# EAGLE design tuer-steuerung (EAGLE 6.5.0)
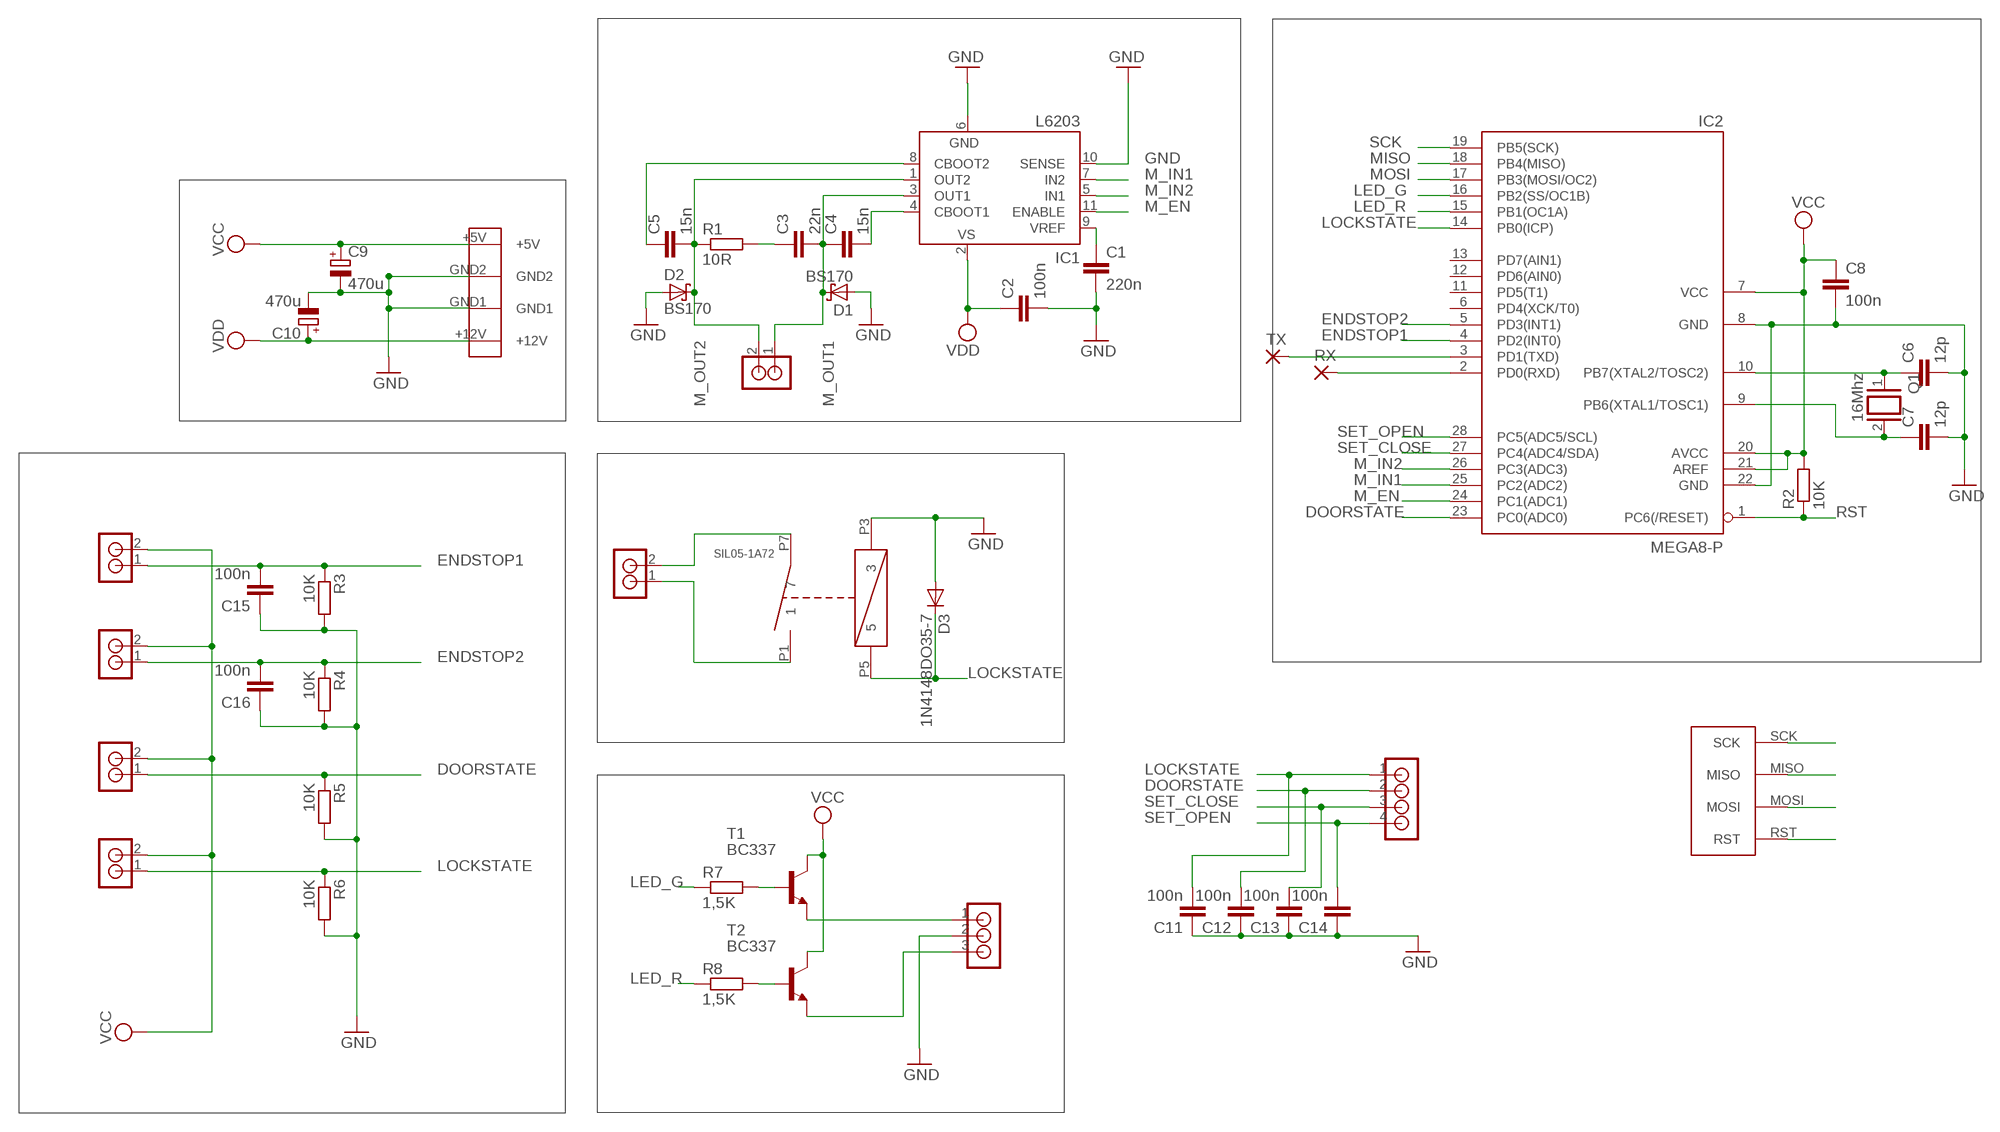
[diagram p0: schematic, sheet 1]

## Parts
C1  220n  C-EU025-024X044  [C025-024X044]
C2  100n  C-EU025-024X044  [C025-024X044]
C3  22n  C-EU025-024X044  [C025-024X044]
C4  15n  C-EU025-024X044  [C025-024X044]
C5  15n  C-EU050-024X044  [C050-024X044]
C6  12p  C-EU050-025X075  [C050-025X075]
C7  12p  C-EU050-025X075  [C050-025X075]
C8  100n  C-EU025-024X044  [C025-024X044]
C9  470u  CPOL-EUTAP5-80  [TAP5-80]
C10  470u  CPOL-EUTAP5-80  [TAP5-80]
C11  100n  C-EU025-024X044  [C025-024X044]
C12  100n  C-EU025-024X044  [C025-024X044]
C13  100n  C-EU025-024X044  [C025-024X044]
C14  100n  C-EU025-024X044  [C025-024X044]
C15  100n  C-EU025-024X044  [C025-024X044]
C16  100n  C-EU025-024X044  [C025-024X044]
D1  BS170  SCHOTTKY-DIODEDO35-7  [DO35-7]
D2  BS170  SCHOTTKY-DIODEDO35-7  [DO35-7]
D3  1N4148DO35-7  [DO35-7]
DOORSTATE  RIACON_101_2  [RIACON_101_2]
ENDSTOP1  RIACON_101_2  [RIACON_101_2]
ENDSTOP2  RIACON_101_2  [RIACON_101_2]
IC1  L6203  [MULTIWATT-11]
IC2  MEGA8-P  [DIL28-3]
LOCKSTATE  RIACON_101_2  [RIACON_101_2]
MOTOR  RIACON_101_2  [RIACON_101_2]
NERDSTERN  RIACON_101_2  [RIACON_101_2]
Q1  16Mhz  XTAL/S  [QS]
R1  10R  R-EU_0207/5V  [0207/5V]
R2  10K  R-EU_0204/5  [0204/5]
R3  10K  R-EU_0204/5  [0204/5]
R4  10K  R-EU_0204/5  [0204/5]
R5  10K  R-EU_0204/5  [0204/5]
R6  10K  R-EU_0204/5  [0204/5]
R7  1,5K  R-EU_0204/5  [0204/5]
R8  1,5K  R-EU_0204/5  [0204/5]
RX  1,6/0,9  [1,6/0,9]
T1  BC337  [TO92]
T2  BC337  [TO92]
TX  1,6/0,9  [1,6/0,9]
U$1  PSW_5  [PSW_5]
U$2  SIL05-1A72  [SIL05-1A72]
U$3  AVR_ISP  [AVR_ISP]
U$4  RIACON_101_3  [RIACON_101_3]
U$5  RIACON_101_4  [RIACON_101_4]

## Nets
DOORSTATE: C12.2 DOORSTATE.1 IC2.23(PC0(ADC0)) R5.1 U$5.2
ENDSTOP1: C15.2 ENDSTOP1.1 IC2.4(PD2(INT0)) R3.1
ENDSTOP2: C16.2 ENDSTOP2.1 IC2.5(PD3(INT1)) R4.1
GND: C1.2 C2.2 C6.2 C7.2 C8.2 C9.- C10.- C11.1 C12.1 C13.1 C14.1 C15.1 C16.1 D1.A D2.A D3.A IC1.6(GND) IC1.10(SENSE) IC2.8(GND) IC2.22(GND) R3.2 R4.2 R5.2 R6.2 U$1.GND1 U$1.GND2 U$2.P3 U$4.2
LED_G: IC2.16(PB2(SS/OC1B)) R7.1
LED_R: IC2.15(PB1(OC1A)) R8.1
LOCKSTATE: C11.2 D3.C IC2.14(PB0(ICP)) LOCKSTATE.1 R6.1 U$2.P5 U$5.1
M_EN: IC1.11(ENABLE) IC2.24(PC1(ADC1))
M_IN1: IC1.7(IN2) IC2.25(PC2(ADC2))
M_IN2: IC1.5(IN1) IC2.26(PC3(ADC3))
M_OUT1: C3.2 C4.1 D1.C IC1.3(OUT1) MOTOR.1
M_OUT2: C5.2 D2.C IC1.1(OUT2) MOTOR.2 R1.1
MISO: IC2.18(PB4(MISO)) U$3.MISO
MOSI: IC2.17(PB3(MOSI/OC2)) U$3.MOSI
N$1: C6.1 IC2.10(PB7(XTAL2/TOSC2)) Q1.1
N$2: C7.1 IC2.9(PB6(XTAL1/TOSC1)) Q1.2
N$3: C1.1 IC1.9(VREF)
N$4: NERDSTERN.2 U$2.P7
N$5: NERDSTERN.1 U$2.P1
N$6: C3.1 R1.2
N$7: C4.2 IC1.4(CBOOT1)
N$8: C5.1 IC1.8(CBOOT2)
N$9: R7.2 T1.2(B)
N$10: R8.2 T2.2(B)
N$11: T1.1(E) U$4.1
N$13: T2.1(E) U$4.3
N$15: IC2.3(PD1(TXD)) TX.1(P)
N$16: IC2.2(PD0(RXD)) RX.1(P)
RST: IC2.1(PC6(/RESET)) R2.1 U$3.RST
SCK: IC2.19(PB5(SCK)) U$3.SCK
SET_CLOSE: C13.2 IC2.27(PC4(ADC4/SDA)) U$5.3
SET_OPEN: C14.2 IC2.28(PC5(ADC5/SCL)) U$5.4
VCC: C8.1 C9.+ DOORSTATE.2 ENDSTOP1.2 ENDSTOP2.2 IC2.7(VCC) IC2.20(AVCC) IC2.21(AREF) LOCKSTATE.2 R2.2 T1.3(C) T2.3(C) U$1.+5V
VDD: C2.1 C10.+ IC1.2(VS) U$1.+12V
Unconnected: IC2.6(PD4(XCK/T0)) IC2.11(PD5(T1)) IC2.12(PD6(AIN0)) IC2.13(PD7(AIN1))

## Power pins joined to a net without a drawn wire
GND: U$3.GND
VCC: U$3.VCC

## Library data of the parts
C1-C8 C11-C16 = resistor:C-EU: CAPACITOR, European symbol
C9 C10 = resistor:CPOL-EU: POLARIZED CAPACITOR, European symbol
D1 D2 = diode:SCHOTTKY-DIODE: Schottky Diode
D3 = diode:1N4148: DIODE high speed (Philips)
DOORSTATE ENDSTOP1 ENDSTOP2 LOCKSTATE MOTOR NERDSTERN = n39:RIACON_101_2: RIACON Anschlussklemme (AKL) Typ 101 Rastermaß 5,08 mm; REICHELT: AKL 101-02
IC1 = st-microelectronics:L6203: DMOS FULL BRIDGE DRIVER; MPN: L6203; OC_FARNELL: 1467715; OC_NEWARK: 56P8434
IC2 = atmel:MEGA8-P: MICROCONTROLLER 8 Kbytes FLASH, 1 kbytes SRAM, 512 bytes EEPROM, USART, 4-channel 10 bit ADC, 2-channel 8 bit ADC Pin compatible with Atmega48, ATMega88, ATMega168 Source: avr.lbr; OC_FARNELL: unknown; OC_NEWARK: unknown
Q1 = special:XTAL/S: CRYSTAL
R1-R8 = resistor:R-EU_: RESISTOR, European symbol
RX TX = wirepad:1,6/0,9: THROUGH-HOLE PAD
T1 T2 = transistor:BC337: NPN TRANSISTOR
U$1 = n39:PSW_5: PSW 5 Stromversorgungsstecker f. 5 1/4 Zoll, Print, gew. http://www.reichelt.de/?ARTICLE=14915
U$2 = n39:SIL05-1A72: MEDER electronics SIL05-1A72-71D Single-In-Line Reed Relays Description Single-In-Line Reed Relays reduce the required space to a minimum. Requiring only half the PCB area of the DIP or DIL series, the SIL relays offer all the advantages of Reed Technology. Characteristics High resistance coils of up to 2000 Ω at 12 VDC Breakdown voltage coil / contact of up to 4.25 kVDC Contact form 1A, 1B or 1C Features Magnetic shield available High resistance version Other coil resistances available Option with coax screen for Z=50 Ohm Impedance
U$3 = n39:AVR_ISP: AVR ISP Pinheader Belegung: 1: MISO 2: VCC 3: SCK 4: MOSI 5: Reset 6: GND
U$4 = n39:RIACON_101_3: RIACON Anschlussklemme (AKL) Typ 101 Rastermaß 5,08 mm; REICHELT: AKL 101-3
U$5 = n39:RIACON_101_4: RIACON Anschlussklemme (AKL) Typ 101 Rastermaß 5,08 mm; REICHELT: AKL 101-04

## Board
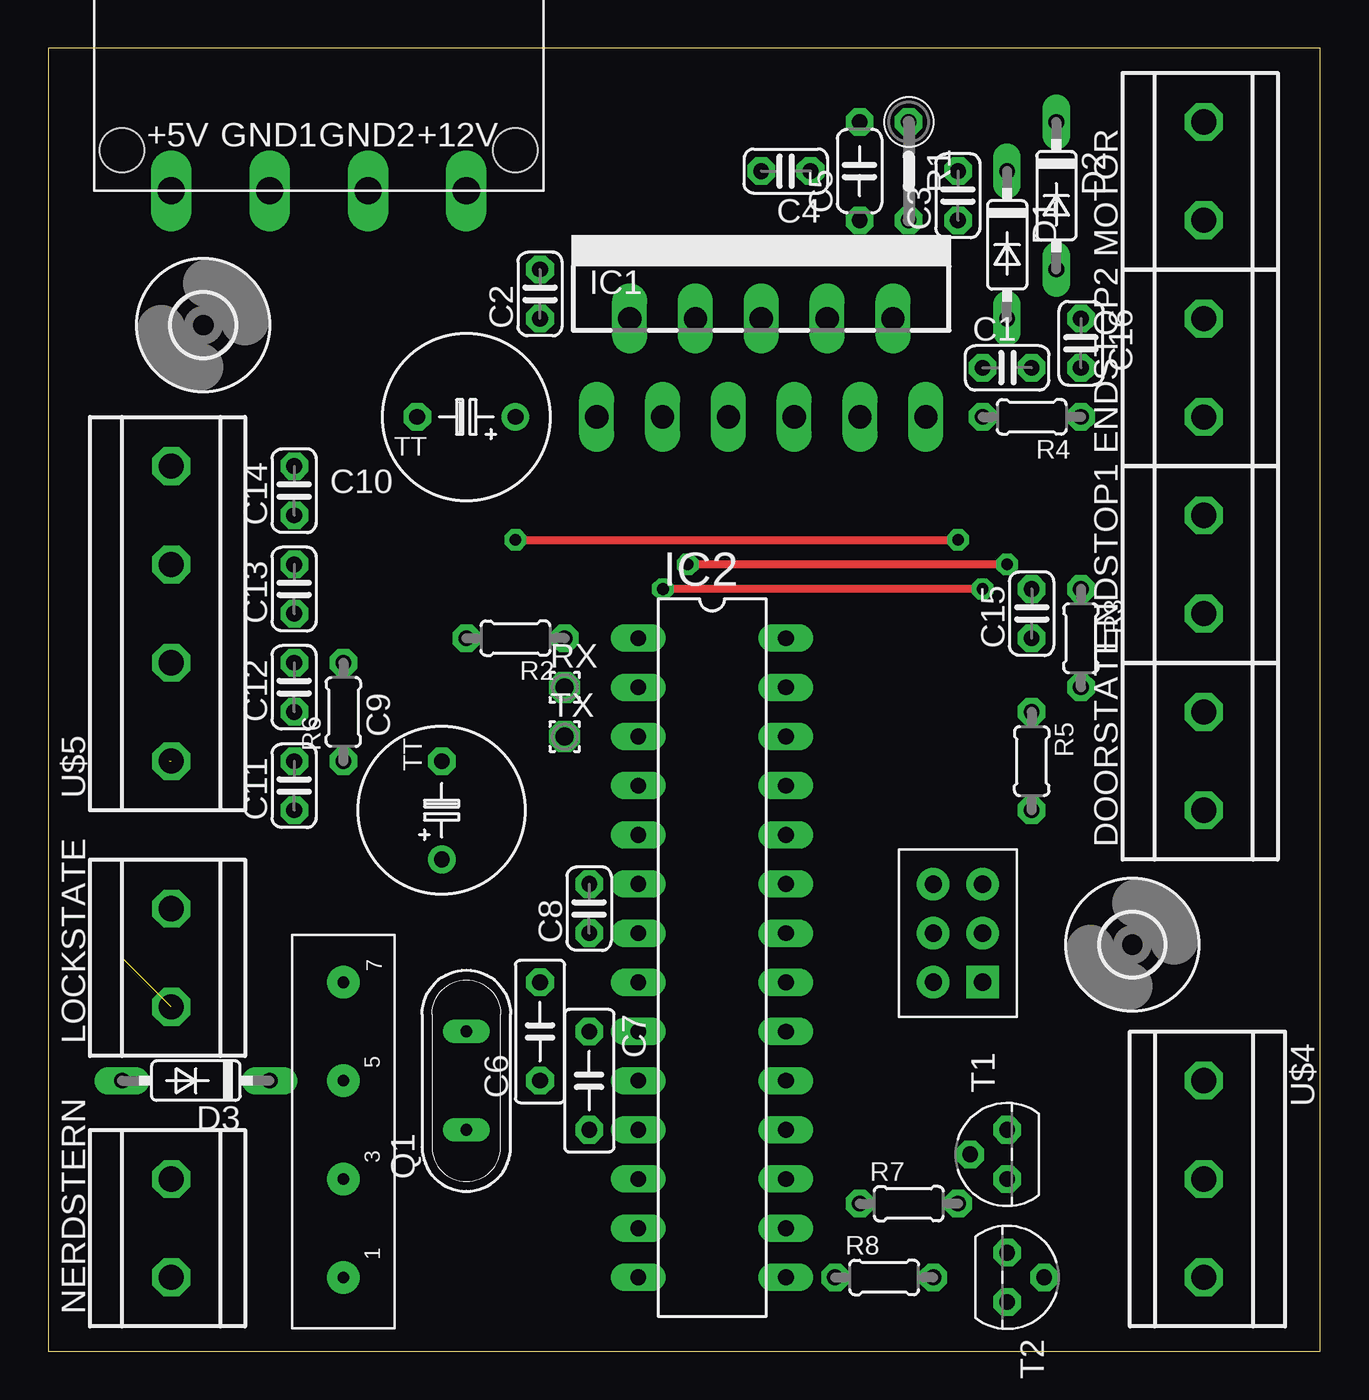
[diagram p1: board, top side]
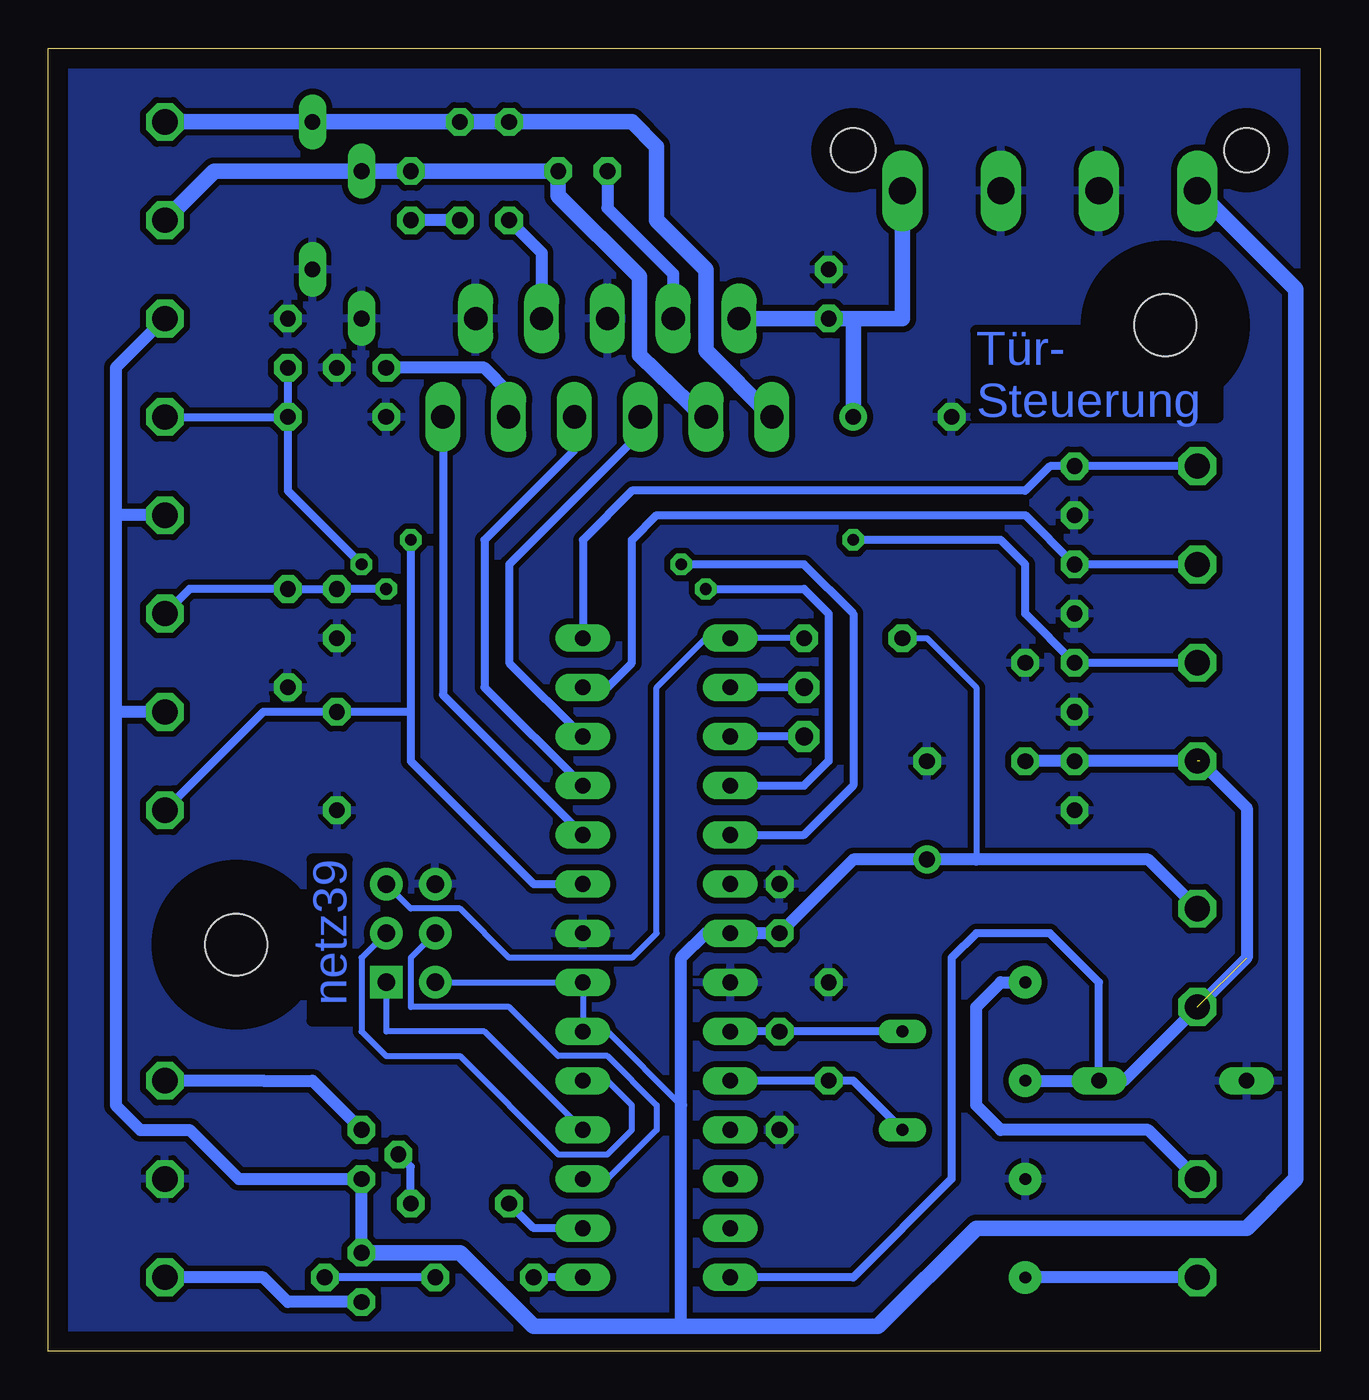
[diagram p2: board, bottom side, seen from below]

Size 65.71 x 67.3 mm. Coordinates in mm from the lower left corner, seen from the top.
Outline: 0,0 65.71,0 65.71,67.3 0,67.3 0,0
Copper layers (1*16): Top 0.035mm / dielectric 1.5mm / Bottom 0.035mm
Design rules "default *": minimum track width 12mil, minimum drill 24mil, track to track 8mil, track to pad 8mil, pad to pad 8mil, via to via 8mil, smd to smd 8mil, copper to edge 40mil, drill to drill 8mil, minimum pad ring 12mil, minimum via ring 10mil, stop-mask expansion 4mil, vias tented up to drill 0mil, thermal gap 10mil

### Footprints (pad centres in the part's own frame; a part is rotated, then mirrored left to right if it is on the bottom)
C025-024X044 = drill 0.813 octagon: 1 -1.27,0; 2 1.27,0
C050-024X044 = drill 0.813 octagon: 1 -2.54,0; 2 2.54,0
C050-025X075 = drill 0.813 octagon: 1 -2.54,0; 2 2.54,0
TAP5-80 = drill 0.813: + -2.54,0 | drill 0.813 octagon: - 2.54,0
DO35-7 = drill 0.813 long: A 3.81,0; C -3.81,0
RIACON_101_2 = drill 1.3 octagon: 1 -2.54,0; 2 2.54,0
MULTIWATT-11 = drill 1.2 long: 1 -8.5,-6.35; 2 -6.8,-1.27; 3 -5.1,-6.35; 4 -3.4,-1.27; 5 -1.7,-6.35; 6 0,-1.27; 7 1.7,-6.35; 8 3.4,-1.27; 9 5.1,-6.35; 10 6.8,-1.27; 11 8.5,-6.35
DIL28-3 = drill 0.813 long: 1 -16.51,-3.81; 2 -13.97,-3.81; 3 -11.43,-3.81; 4 -8.89,-3.81; 5 -6.35,-3.81; 6 -3.81,-3.81; 7 -1.27,-3.81; 8 1.27,-3.81; 9 3.81,-3.81; 10 6.35,-3.81; 11 8.89,-3.81; 12 11.43,-3.81; 13 13.97,-3.81; 14 16.51,-3.81; 15 16.51,3.81; 16 13.97,3.81; 17 11.43,3.81; 18 8.89,3.81; 19 6.35,3.81; 20 3.81,3.81; 21 1.27,3.81; 22 -1.27,3.81; 23 -3.81,3.81; 24 -6.35,3.81; 25 -8.89,3.81; 26 -11.43,3.81; 27 -13.97,3.81; 28 -16.51,3.81
QS = drill 0.61 long: 1 -2.54,0; 2 2.54,0
0207/5V = drill 0.813 octagon: 1 -2.54,0; 2 2.54,0
0204/5 = drill 0.813 octagon: 1 -2.54,0; 2 2.54,0
1,6/0,9 = drill 0.914 pad 1.6 octagon: 1 0,0
TO92 = drill 0.813 octagon: 1 1.27,0; 2 0,1.905; 3 -1.27,0
PSW_5 = drill 1.4 long: +5V -7.62,-6.1; +12V 7.62,-6.1; GND1 -2.54,-6.1; GND2 2.54,-6.1 | hole 2.3: -10.16,-4; 10.16,-4
SIL05-1A72 = drill 0.6 pad 1.676: P1 -7.62,0; P3 -2.54,0; P5 2.54,0; P7 7.62,0
AVR_ISP = drill 0.9 pad 1.676: GND 1.27,-2.54; MOSI 1.27,0; RST -1.27,-2.54; SCK -1.27,0; VCC 1.27,2.54 | drill 0.9 pad 1.676 square: MISO -1.27,2.54
RIACON_101_3 = drill 1.3 octagon: 1 -5.08,0; 2 0,0; 3 5.08,0
RIACON_101_4 = drill 1.3 octagon: 1 -7.62,0; 2 -2.54,0; 3 2.54,0; 4 7.62,0
3,2 = hole 3.2: 0,0

### Placement (x,y rotation side)
C1  49.53,50.8 0 top
C2  25.4,54.61 90 top
C3  46.99,59.69 90 top
C4  38.1,60.96 180 top
C5  41.91,60.96 90 top
C6  25.4,16.51 90 top
C7  27.94,13.97 270 top
C8  27.94,22.86 90 top
C9  20.32,27.94 90 top
C10  21.59,48.26 180 top
C11  12.7,29.21 90 top
C12  12.7,34.29 90 top
C13  12.7,39.37 90 top
C14  12.7,44.45 90 top
C15  50.8,38.1 90 top
C16  53.34,52.07 270 top
D1  49.53,57.15 270 top
D2  52.07,59.69 270 top
D3  7.62,13.97 180 top
DOORSTATE  59.69,30.48 90 top
ENDSTOP1  59.69,40.64 90 top
ENDSTOP2  59.69,50.8 90 top
IC1  36.83,54.61 0 top
IC2  34.29,20.32 270 top
LOCKSTATE  6.35,20.32 90 top
MOTOR  59.69,60.96 90 top
NERDSTERN  6.35,6.35 90 top
Q1  21.59,13.97 90 top
R1  44.45,60.96 270 top
R2  24.13,36.83 180 top
R3  53.34,36.83 270 top
R4  50.8,48.26 180 top
R5  50.8,30.48 270 top
R6  15.24,33.02 90 top
R7  44.45,7.62 0 top
R8  43.18,3.81 0 top
RX  26.67,34.29 0 top
T1  49.53,10.16 90 top
T2  49.53,3.81 270 top
TX  26.67,31.75 0 top
U$1  13.97,66.04 0 top
U$2  15.24,11.43 90 top
U$3  46.99,21.59 180 top
U$4  59.69,8.89 270 top
U$5  6.35,38.1 90 top
U$6  [3,2]  8,53 0 top
U$7  [3,2]  56,21 0 top

### Tracks (layer width: path | path; a pad name or v marks a point on that pad's centre or on a via)
DOORSTATE  (via drill 0.6)
  Top 0.406: v24.13,41.91 v46.99,41.91
  Bottom 0.406: v24.13,41.91 16.51,41.91 15.24,40.64 15.24,38.1 C12.2 U$5.2 | v46.99,41.91 46.99,33.02 | 46.99,33.02 R5.1 54.61,33.02 DOORSTATE.1 | 46.99,33.02 46.99,30.48 40.64,24.13 IC2.23
ENDSTOP1  (via drill 0.6)
  Top 0.406: v48.26,39.37 v31.75,39.37
  Bottom 0.406: v48.26,39.37 C15.2 R3.1 58.42,39.37 ENDSTOP1.1 | v31.75,39.37 26.67,39.37 25.4,38.1 25.4,30.48 26.67,29.21 IC2.4
ENDSTOP2  (via drill 0.6)
  Top 0.406: v49.53,40.64 v33.02,40.64
  Bottom 0.406: v33.02,40.64 26.67,40.64 24.13,38.1 24.13,29.21 26.67,26.67 IC2.5 | C16.2 R4.1 | R4.1 53.34,44.45 v49.53,40.64 | ENDSTOP2.1 R4.1
GND
  pour Bottom (isolate 0.305): 0,66.04 66.04,66.04 66.04,0 0,0
LED_G
  Bottom 0.406: IC2.16 40.64,6.35 R7.1
LED_R
  Bottom 0.406: IC2.15 R8.1
LOCKSTATE  (2 unrouted)
  Bottom 0.406: D3.C 11.43,19.05 13.97,21.59 17.78,21.59 19.05,20.32 19.05,8.89 24.13,3.81 IC2.14
  Bottom 0.61: U$2.P5 D3.C 10.16,13.97 3.81,20.32 3.81,28.06 6.23,30.48 C11.2 R6.1
M_EN
  Bottom 0.406: IC1.11 45.33,33.9 IC2.24
M_IN1
  Bottom 0.406: IC2.25 43.18,34.29 43.18,41.91 38.53,46.56 IC1.7
M_IN2
  Bottom 0.406: IC1.5 35.13,47.42 41.91,40.64 41.91,35.56 IC2.26
M_OUT1
  Bottom 0.406: 31.75,48.26 IC1.3
  Bottom 0.61: 31.75,48.13 31.75,48.26
  Bottom 0.813: 31.75,48.13 35.18,51.45 35.18,55.5 39.37,59.69 C4.1 C3.2 D1.C 57.15,60.96 59.05,59.05 MOTOR.1
M_OUT2
  Bottom 0.813: IC1.1 31.75,51.68 31.75,55.88 34.29,58.42 34.29,62.23 35.56,63.5 C5.2 R1.1 D2.C MOTOR.2
MISO
  Bottom 0.305: U$3.MISO 48.26,16.51 43.18,16.51 IC2.18
MOSI
  Bottom 0.305: IC2.17 36.83,8.89 34.29,11.43 34.29,12.7 36.83,15.24 39.37,15.24 41.91,17.78 46.99,17.78 46.99,20.32 U$3.MOSI
N$1
  Bottom 0.406: Q1.1 24.13,13.97 C6.1 IC2.10
N$2
  Bottom 0.406: Q1.2 C7.1 IC2.9
N$3
  Bottom 0.406: IC1.9 41.91,48.24 41.91,49.53
  Bottom 0.61: 41.91,49.53 43.18,50.8 C1.1
N$4
  Bottom 0.61: U$2.P7 16.51,19.05 17.78,17.78 17.78,12.7 16.51,11.43 8.89,11.43 NERDSTERN.2
N$5
  Bottom 0.61: NERDSTERN.1 U$2.P1
N$6
  Bottom 0.61: R1.2 C3.1
N$7
  Bottom 0.61: C4.2 36.83,59.05 33.43,55.66 IC1.4
N$8
  Bottom 0.61: C5.1 40.23,56.74 IC1.8
N$9
  Bottom 0.406: R7.2 46.99,9.53 T1.2
N$10
  Bottom 0.406: R8.2 T2.2
N$11
  Bottom 0.61: U$4.1 54.61,13.97 52.07,13.97 T1.1
N$13
  Bottom 0.61: U$4.3 54.61,3.81 53.34,2.54 T2.1
N$15
  Bottom 0.406: TX.1 IC2.3
N$16
  Bottom 0.406: RX.1 IC2.2
RST
  Bottom 0.305: U$3.RST 46.99,22.86 44.45,22.86 41.91,20.32 35.56,20.32 34.29,21.59 34.29,34.29 31.75,36.83 IC2.1 R2.1
SCK
  Bottom 0.305: IC2.19 36.83,13.97 35.56,12.7 35.56,11.43 36.83,10.16 39.37,10.16 44.45,15.24 48.26,15.24 49.53,16.51 49.53,20.32 U$3.SCK
SET_CLOSE
  Bottom 0.406: IC2.27 36.83,34.29 35.56,35.56 35.56,41.91 34.29,43.18 15.24,43.18 C13.2 U$5.3
SET_OPEN
  Bottom 0.406: IC2.28 38.1,41.91 35.56,44.45 15.24,44.45 13.97,45.72 C14.2 U$5.4
VCC
  Bottom 0.305: 33.02,12.7 36.83,16.51 IC2.20 IC2.21 U$3.VCC | R2.2 20.32,36.83 17.78,34.29 17.78,25.4
  Bottom 0.61: 33.02,1.27 33.02,12.7 33.02,20.32 31.75,21.59 IC2.7 C8.1 24.13,25.4 C9.+ 17.78,25.4 8.89,25.4 LOCKSTATE.2 | T2.3 T1.3 55.88,8.89 58.42,11.43 60.96,11.43 62.23,12.7 62.23,33.02 | ENDSTOP2.2 62.23,50.8 62.23,43.18 | 62.23,43.18 62.23,33.02 | ENDSTOP1.2 62.23,43.18 | DOORSTATE.2 62.23,33.02
  Bottom 0.813: T2.3 44.45,5.08 40.64,1.27 33.02,1.27 22.86,1.27 17.78,6.35 3.81,6.35 1.27,8.89 1.27,54.86 U$1.+5V
VDD
  Bottom 0.813: IC1.2 C2.1 24.13,53.34 | U$1.+12V 21.59,53.34 24.13,53.34 | C10.+ 24.13,53.34

### Text on the board
Bottom: Tür- / Steuerung | netz39